# EAGLE design piezo-preamp-tickler_V2-RevD (EAGLE 8.2.1)

## Sheet 1 of 2
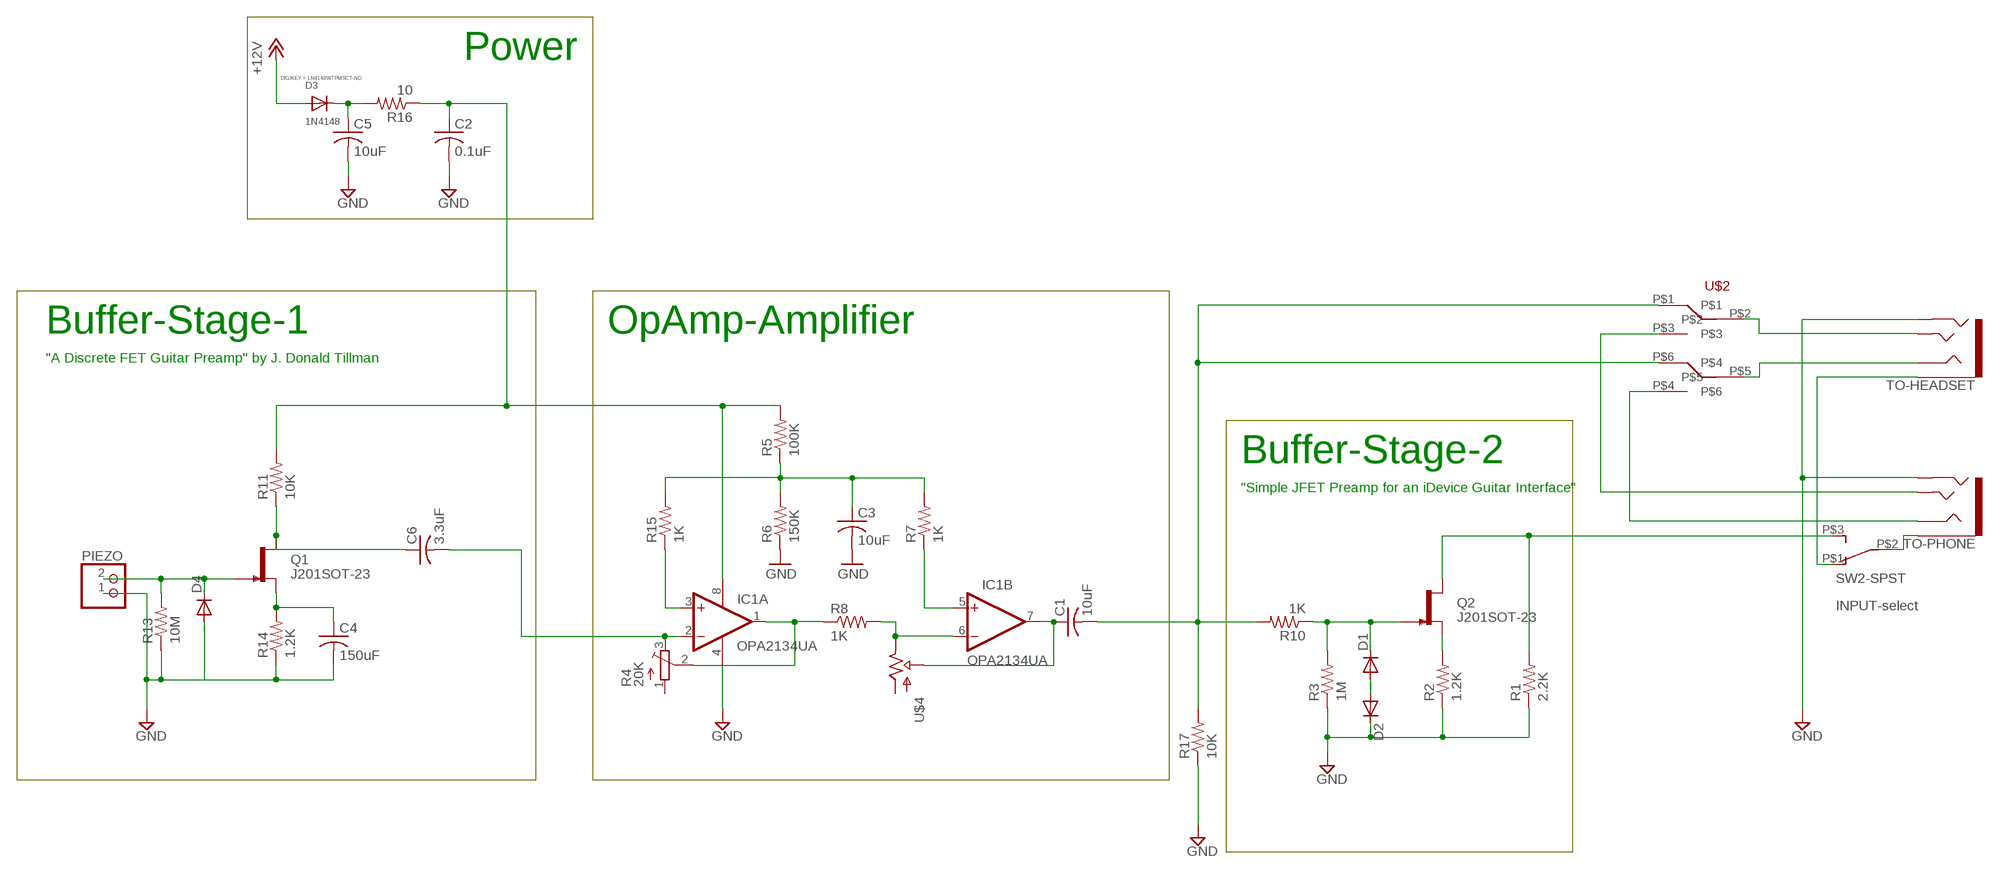
[diagram p0: schematic, sheet 1]

### Parts
C1  10uF  C-USC0805K  [C0805K]
C2  0.1uF  C-USC0805K  [C0805K]
C3  10uF  C-USC0805K  [C0805K]
C4  150uF  C-USC3216  [C3216]
C5  10uF  C-USC0805K  [C0805K]
C6  3.3uF  C-USC0805K  [C0805K]
D1  DIODE-SOD123  [SOD123]
D2  DIODE-SOD123  [SOD123]
D3  1N4148  DIODESOD-123  [SOD-123]
D4  DIODE-SOD123  [SOD123]
IC1  OPA2134UA  [SO08]
PIEZO  JST_2PIN-THM  [JST-PH-2-THM]
Q1  J201SOT-23  [SOT23-3]
Q2  J201SOT-23  [SOT23-3]
R1  2.2K  R-US_R0603  [R0603]
R2  1.2K  R-US_R0603  [R0603]
R3  1M  R-US_R0603  [R0603]
R4  20K  TRIMPOTTC33X  [TC33X]
R5  100K  R-US_R0603  [R0603]
R6  150K  R-US_R0603  [R0603]
R7  1K  R-US_R0603  [R0603]
R8  1K  R-US_R0603  [R0603]
R10  1K  R-US_R0603  [R0603]
R11  10K  R-US_R0603  [R0603]
R13  10M  R-US_R0603  [R0603]
R14  1.2K  R-US_R0603  [R0603]
R15  1K  R-US_R0603  [R0603]
R16  10  R-US_R0603  [R0603]
R17  10K  R-US_R0603  [R0603]
SW2-SPST  INPUT-select  SWITCH_SPDTCL-SB-12B  [SWITCH_SPDT_CL-SB-12B]
TO-HEADSET  AUDIO-JACK3LGPADS  [AUDIO-JACK-TRRS-SMD]
TO-PHONE  AUDIO-JACK3LGPADS  [AUDIO-JACK-TRRS-SMD]
U$2  SWITCH_DPDT  [SWITCH_DPDT_CL-SB-12B]
U$4  POT  [ALPS_POT]

### Nets
+12V: D3.A ; also sheet 2
GND: C2.2 C3.2 C4.2 C5.2 D2.C D4.A IC1.4(A:V-) PIEZO.1 R1.1 R2.1 R3.1 R6.1 R13.1 R14.1 R17.1 TO-HEADSET.RING2 TO-PHONE.RING2 ; also sheet 2
N$1: D1.A D2.A
N$2: D4.C PIEZO.2 Q1.3(G) R13.2
N$3: Q2.2(S) R2.2
N$5: IC1.5(B:+IN) R7.1
N$6: C1.1 IC1.7(B:OUT) U$4.P$2(WIPER)
N$7: IC1.6(B:-IN) R8.2 U$4.P$1(OUT)
N$9: C6.1 Q1.1(D) R11.1
N$10: D1.C Q2.3(G) R3.2 R10.1
N$11: C1.2 R10.2 R17.2 U$2.P$1 U$2.P$6
N$12: SW2-SPST.P$1 TO-HEADSET.EARTH
N$13: TO-HEADSET.TIP U$2.P$2
N$14: C4.1 Q1.2(S) R14.2
N$15: TO-HEADSET.RING1 U$2.P$5
N$16: C5.1 D3.C R16.2
N$17: SW2-SPST.P$2 TO-PHONE.EARTH
N$22: IC1.3(A:+IN) R15.1
N$23: C3.1 R5.1 R6.2 R7.2 R15.2
N$24: IC1.1(A:OUT) R4.2(S) R8.1
N$25: C2.1 IC1.8(A:V+) R5.2 R11.2 R16.1
N$26: TO-PHONE.RING1 U$2.P$4
N$27: TO-PHONE.TIP U$2.P$3
N$28: C6.2 IC1.2(A:-IN) R4.3(E)
SELECT: Q2.1(D) R1.2 SW2-SPST.P$3
Unconnected: R4.1(A) U$4.P$3(IN)

### Notes on the sheet
- Power
- Buffer-Stage-1 | OpAmp-Amplifier
- "A Discrete FET Guitar Preamp" by J. Donald Tillman
- Buffer-Stage-2
- "Simple JFET Preamp for an iDevice Guitar Interface"

## Sheet 2 of 2
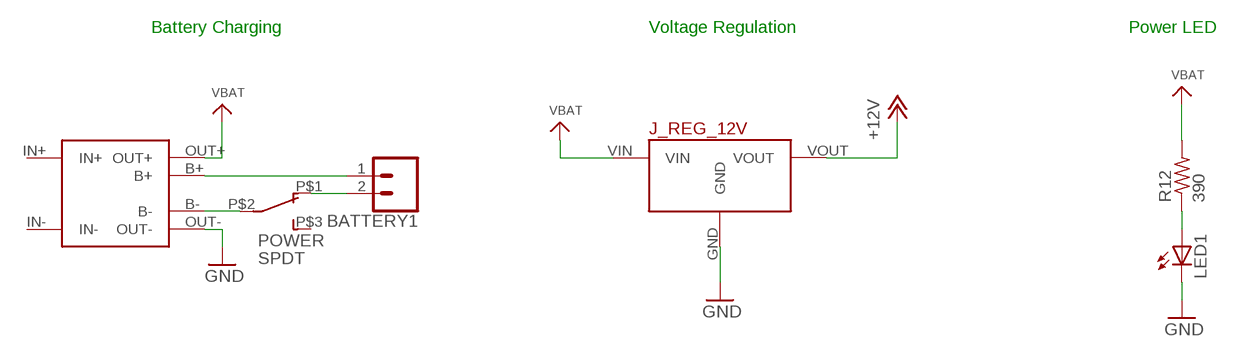
[diagram p1: schematic, sheet 2]

### Parts
BATTERY1  CONN_02LOCK  [1X02_LOCK]
J_REG_12V  POLOLU_VOLTAGE_REGULATORS_3PIN  [POLOLU_5V-12V_STEPUP_U3V12F5-U3V12F12]
LED1  LED3MM  [LED3MM]
POWER  SPDT  SWITCH_SPDTCL-SB-12B  [SWITCH_SPDT_CL-SB-12B]
R12  390  R-US_R0805  [R0805]
USB-LIPO-CHARGER  TP4056-MODULE  [TP4056-LITHIUM-PROTECTED-MODULE]

### Nets
+12V: J_REG_12V.VOUT ; also sheet 1
GND: J_REG_12V.GND LED1.K(C) USB-LIPO-CHARGER.OUT- ; also sheet 1
N$18: LED1.A R12.1
N$19: BATTERY1.1 USB-LIPO-CHARGER.B+
N$20: POWER.P$2 USB-LIPO-CHARGER.B-
N$21: BATTERY1.2 POWER.P$1
VBAT: J_REG_12V.VIN R12.2 USB-LIPO-CHARGER.OUT+
Unconnected: POWER.P$3

### Notes on the sheet
- Battery Charging | Voltage Regulation | Power LED

## Power pins joined to a net without a drawn wire
IN+: USB-LIPO-CHARGER.IN+
IN-: USB-LIPO-CHARGER.IN-

## Library data of the parts
BATTERY1 = SparkFun-Connectors:CONN_02: Multi connection point. Often used as Generic Header-pin footprint for 0.1 inch spaced/style header connections On any of the 0.1 inch spaced packages, you can populate with these: Break Away Headers - Straight <https://www.sparkfun.com/products/116> (PRT-00116) Break Away Male Headers - Right Angle <https://www.sparkfun.com/products/553> (PRT-00553) Female Headers <https://www.sparkfun.com/products/115> (PRT-00115) Break Away Headers - Machine Pin <https://www.sparkfun.com/products/117> (PRT-00117) Break Away Female Headers - Swiss Machine Pin <https://www.sparkfun.com/products/743> (PRT-00743) For SCREWTERMINALS and SPRING TERMINALS visit here: Screw Terimnals on SparkFun.com <https://www.sparkfun.com/search/results?term=Screw+Terminals> (5mm/3.5mm/2.54mm spacing) This device is also useful as a general connection point to wire up your design to another part of your project. Our various solder wires solder well into these plated through hole pads. Hook-Up Wire - Assortment (Stranded, 22 AWG) <https://www.sparkfun.com/products/11375> (PRT-11375) Hook-Up Wire - Assortment (Solid Core, 22 AWG) <https://www.sparkfun.com/products/11367> (PRT-11367) View the entire wire category on our website here <https://www.sparkfun.com/categories/141> Special notes: Molex polarized connector foot print use with: PRT-08233 with associated crimp pins and housings. 2.54_SCREWTERM for use with PRT-10571. 3.5mm Screw Terminal footprints for PRT-08084 5mm Screw Terminal footprints for use with PRT-08432
C1-C6 = adafruit:C-US: CAPACITOR, American symbol
D1 D2 D4 = diode:DIODE-: DIODE
D3 = adafruit:DIODE: Diode SMADIODE - SMA Surface Mount Package 20V 1A Schottky Diode Digikey: 641-1014-6-ND DO-1N4148 - Through Hole Small Current Diode SOD-123 20V 1 A (.5mV Vf) Schottky Diode - Digikey: MBRX120TPMSCT-ND SOD-323 10V 570mA (.38mV Vf, 3ns) Schottky Diode - Digikey: ZLLS410CT-ND SOD-523 30V 30mA Schottky Diode (RB751S-40TE61) - Digikey: RB751S-40TE61CT-ND SOT23-R/W - SOT23 Package (R = Solder Paste/Reflow Ovens, W = Hand-Soldering) BAT54Film 40V 300mA - Digikey: 497-7162-1-ND; DIGIKEY: 1N4148WTPMSCT-ND
IC1 = linear:OPA2*: Dual Operational Amplifier Low Power, Single-Supply, Rail-To-Rail Operational Amplifier Source: http://focus.ti.com/lit/ds/symlink/opa2345.pdf http://focus.ti.com .. opa241.pdf http://focus.ti.com/lit/ds/symlink/opa2134.pdf
J_REG_12V = CMU-ArtFab:POLOLU_VOLTAGE_REGULATORS_3PIN: Polulu 5V Step-Up/Step-Down Voltage REgulator S7V7F5
LED1 = led:LED: LED OSRAM: - CHIPLED LG R971, LG N971, LY N971, LG Q971, LY Q971, LO R971, LY R971 LH N974, LH R974 LS Q976, LO Q976, LY Q976 LO Q996 - Hyper CHIPLED LW Q18S LB Q993, LB Q99A, LB R99A - SideLED LS A670, LO A670, LY A670, LG A670, LP A670 LB A673, LV A673, LT A673, LW A673 LH A674 LY A675 LS A676, LA A676, LO A676, LY A676, LW A676 LS A679, LY A679, LG A679 - Hyper Micro SIDELED® LS Y876, LA Y876, LO Y876, LY Y876 LT Y87S - SmartLED LW L88C, LW L88S LB L89C, LB L89S, LG L890 LS L89K, LO L89K, LY L89K LS L896, LA L896, LO L896, LY L896 - TOPLED LS T670, LO T670, LY T670, LG T670, LP T670 LSG T670, LSP T670, LSY T670, LOP T670, LYG T670 LG T671, LOG T671, LSG T671 LB T673, LV T673, LT T673, LW T673 LH T674 LS T676, LA T676, LO T676, LY T676, LB T676, LH T676, LSB T676, LW T676 LB T67C, LV T67C, LT T67C, LS T67K, LO T67K, LY T67K, LW E67C LS E67B, LA E67B, LO E67B, LY E67B, LB E67C, LV E67C, LT E67C LW T67C LS T679, LY T679, LG T679 LS T770, LO T770, LY T770, LG T770, LP T770 LB T773, LV T773, LT T773, LW T773 LH T774 LS E675, LA E675, LY E675, LS T675 LS T776, LA T776, LO T776, LY T776, LB T776 LHGB T686 LT T68C, LB T68C - Hyper Mini TOPLED® LB M676 - Mini TOPLED Santana® LG M470 LS M47K, LO M47K, LY M47K Source: http://www.osram.convergy.de LUXEON: - LUMILED® LXK2-PW12-R00, LXK2-PW12-S00, LXK2-PW14-U00, LXK2-PW14-V00 LXK2-PM12-R00, LXK2-PM12-S00, LXK2-PM14-U00 LXK2-PE12-Q00, LXK2-PE12-R00, LXK2-PE12-S00, LXK2-PE14-T00, LXK2-PE14-U00 LXK2-PB12-K00, LXK2-PB12-L00, LXK2-PB12-M00, LXK2-PB14-N00, LXK2-PB14-P00, LXK2-PB14-Q00 LXK2-PR12-L00, LXK2-PR12-M00, LXK2-PR14-Q00, LXK2-PR14-R00 LXK2-PD12-Q00, LXK2-PD12-R00, LXK2-PD12-S00 LXK2-PH12-R00, LXK2-PH12-S00 LXK2-PL12-P00, LXK2-PL12-Q00, LXK2-PL12-R00 Source: www.luxeon.com KINGBRIGHT: KA-3528ASYC Source: www.kingbright.com
PIEZO = adafruit:JST_2PIN: JST 2-Pin Connectors of various flavors SMT-RA (S2B-PH-SM4) 4UConnector #17311 SMT (B2B-PH-SM4) THM-RA (S2B-PH) THM (B2B-PH)
POWER SW2-SPST = CMU-ArtFab:SWITCH_SPDT
Q1 Q2 = CMU-ArtFab:J201: N-channel JFET
R1-R3 R5-R8 R10-R17 = CMU-ArtFab:R-US_: RESISTOR, American symbol
R4 = adafruit:TRIMPOT: SMT trimmer potentiometer part number TC33X http://www.ladyada.net/library/eagle
TO-HEADSET TO-PHONE = Daniel:AUDIO-JACK3: Audio jack - 3.5mm TRRS variety - two rings.
U$2 = CMU-ArtFab:SWITCH_DPDT
U$4 = CMU-ArtFab:POT
USB-LIPO-CHARGER = CMU-ArtFab:TP4056-MODULE

## Net classes
0 default: width 0.152 mm, clearance 0.2 mm

## Board
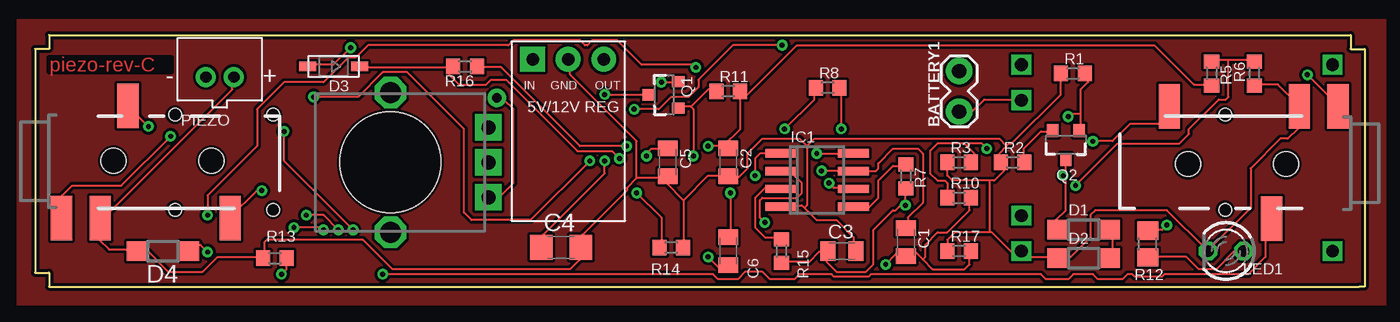
[diagram p2: board, top side]
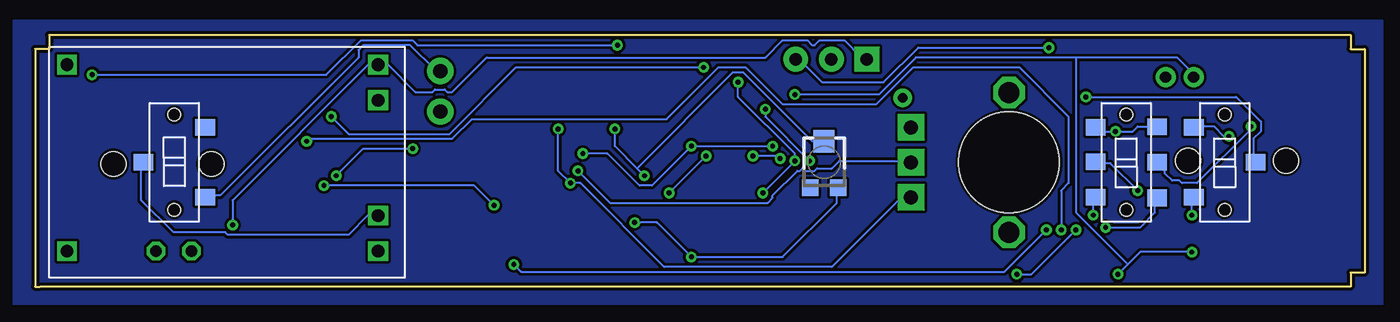
[diagram p3: board, bottom side, seen from below]

Size 95 x 18 mm. Coordinates in mm from the lower left corner, seen from the top.
Outline: 94.61,0 94.96,0
Outline: 94.61,0 1,0 1,1 0,1 0,17 1,17 1,18 94,18 94,17 95,17 95,0 94.61,0
Copper layers (1*16): Top 0.035mm / dielectric 1.5mm / Bottom 0.035mm
Design rules "default *": minimum track width 6mil, minimum drill 0.35mm, track to track 6mil, track to pad 6mil, pad to pad 6mil, via to via 6mil, smd to smd 6mil, copper to edge 8mil, drill to drill 6mil, minimum pad ring 10mil, minimum via ring 8mil, stop-mask expansion 4mil, vias tented up to drill 20mil, thermal gap 10mil

### Footprints (pad centres in the part's own frame; a part is rotated, then mirrored left to right if it is on the bottom)
1X02_LOCK = drill 1.016 pad 1.88: 1 -0.178,0; 2 2.718,0
C0805K = smd 1.1 x 1.4: 1 -1,0; 2 1,0
C3216 = smd 1.6 x 1.8: 1 -1.4,0; 2 1.4,0
SOD123 = smd 1.4 x 1.4: A 1.9,0; C -1.9,0
SOD-123 = smd 1.2 x 0.7: A 1.85,0; C -1.85,0
SO08 = smd 0.6 x 2.2: 1 -1.905,-2.6; 2 -0.635,-2.6; 3 0.635,-2.6; 4 1.905,-2.6; 5 1.905,2.6; 6 0.635,2.6; 7 -0.635,2.6; 8 -1.905,2.6
POLOLU_5V-12V_STEPUP_U3V12F5-U3V12F12 = drill 0.9 pad 1.778: GND 0,-6.35; VOUT -2.54,-6.35 | drill 0.9 pad 1.778 square: VIN 2.54,-6.35
LED3MM = drill 0.813 octagon: A -1.27,0; K 1.27,0
JST-PH-2-THM = drill 0.8 pad 1.422: 1 1,0; 2 -1,0
SWITCH_SPDT_CL-SB-12B = smd 1.2 x 1.4: P$1 -2.5,-2.2; P$2 0,2.2; P$3 2.5,-2.2 | hole 0.9: -3.4,0; 3.4,0
SOT23-3 = smd 0.8 x 0.9: 1 -0.95,-1; 2 0.95,-1; 3 0,1.1
R0603 = smd 1 x 1.1: 1 -0.85,0; 2 0.85,0
TC33X = smd 1.2 x 1.2: 1 -1,-1.825; 3 1,-1.825 | smd 1.5 x 1.6: 2 0,1.5
R0805 = smd 1.3 x 1.5: 1 -0.95,0; 2 0.95,0
AUDIO-JACK-TRRS-SMD = smd 1.524 x 3.175: EARTH -2.114,-5.271; RING1 2.644,2.759; RING2 0.66,-5.271; TIP 9.948,-5.271 | hole 1.778: 1.6,-1.15; 8.6,-1.15
SWITCH_DPDT_CL-SB-12B = smd 1.2 x 1.4: P$1 -2.5,-2.2; P$2 -0.04,-2.2; P$3 2.5,-2.2; P$4 2.54,2.2; P$5 0,2.2; P$6 -2.54,2.2 | hole 0.9: -3.4,0; 3.4,0
ALPS_POT = drill 1 pad 1.88 square: P$1 7,-2.5; P$2 7,0; P$3 7,2.5 | drill 1.5 octagon: P$4 0,-5; P$5 0,5 | hole 7.2: 0,0
TP4056-LITHIUM-PROTECTED-MODULE = drill 0.9 square: B+ 10.795,4.445; B- 10.795,-3.81; IN+ -11.43,6.985; IN- -11.43,-6.35; OUT+ 10.795,6.985; OUT- 10.795,-6.35

### Placement (x,y rotation side)
BATTERY1  66.04,12.7 90 top
C1  62.23,3.17 270 top
C2  49.53,8.89 270 top
C3  57.66,2.54 0 top
C4  37.59,2.79 0 top
C5  45.21,8.89 270 top
C6  49.53,2.54 270 top
D1  74.93,4.06 0 top
D2  74.93,2.03 0 top
D3  21.34,15.75 180 top
D4  9.14,2.54 180 top
IC1  55.88,7.62 270 top
J_REG_12V  38.1,9.91 180 top
LED1  85.09,2.54 180 top
PIEZO  13.21,14.99 0 top
POWER  85.04,8.89 90 bottom
Q1  44.96,13.72 90 top
Q2  73.66,10.16 180 top
R1  74.17,15.24 0 top
R2  69.85,8.89 0 top
R3  66.04,8.89 0 top
R4  38.61,8.89 0 bottom
R5  84.07,15.24 270 top
R6  87.12,15.24 90 top
R7  62.23,7.87 270 top
R8  56.64,14.22 0 top
R10  66.04,6.35 0 top
R11  49.53,13.97 0 top
R12  79.5,3.05 90 top
R13  17.14,2.03 0 top
R14  45.47,2.79 180 top
R15  53.34,2.54 270 top
R16  30.73,15.75 180 top
R17  66.04,2.54 0 top
SW2-SPST  10,8.89 270 bottom
TO-HEADSET  4,10.16 0 top
TO-PHONE  91,7.62 180 top
U$2  17.02,8.89 270 bottom
U$4  25.4,8.89 0 top
USB-LIPO-CHARGER  81.28,8.89 0 bottom

### Tracks (layer width: path | path; a pad name or v marks a point on that pad's centre or on a via)
+12V  (via drill 0.35)
  Top 0.152: v22.55,17.09 21.32,15.86 19.56,15.86 D3.A
  Bottom 0.152: v22.55,17.09 31.89,17.09 34.36,14.62 38.76,14.62 40.53,16.39 J_REG_12V.VOUT
GND
  Top 0.152: 68.19,3.88 68.37,3.88 69.78,2.47 70.48,2.47 USB-LIPO-CHARGER.OUT- 70.66,2.47 71.01,2.11 72.95,2.11 D2.C 73.12,2.11 74,2.11 75.41,3.52 75.41,5.11 75.77,5.46 80.88,5.46 83.69,2.64 LED1.K 83.87,2.64 86.87,5.64 86.87,8.46 88.98,10.57 89.51,10.57 90.21,11.28 90.21,12.86 TO-PHONE.RING2 90.21,13.04 88.81,14.45 87.22,14.45 R6.1 | 68.19,3.88 65.72,3.88 65.19,3.35 65.19,2.64 R17.1 | 68.19,7.58 68.54,7.58 69.25,8.28 69.25,8.63 69.07,8.81 R2.1 68.89,8.99 68.89,9.52 69.42,10.04 | 68.19,7.58 65.55,7.58 65.19,7.93 65.19,8.81 R3.1 | 69.42,10.04 69.6,10.22 69.78,10.22 73.3,13.74 73.3,15.15 R1.1 | 68.19,7.58 68.19,3.88 | PIEZO.1 14.1,14.98 14.1,14.1 4.76,4.76 TO-HEADSET.RING2 4.58,4.76 4.58,3.35 5.29,2.64 7.22,2.64 D4.A 7.4,2.64 7.93,2.64 9.52,1.06 11.98,1.06 13.04,2.11 16.21,2.11 R13.1 16.39,2.11 16.39,3.17 16.56,3.35 23.43,3.35 25.55,1.23 38.23,1.23 38.94,1.94 38.94,2.64 C4.2 39.12,2.82 39.12,3.7 42.29,6.87 42.29,7.05 42.99,7.75 | 54.97,5.64 54.8,5.82 53.39,5.82 IC1.4 | 54.97,5.64 55.85,4.76 57.27,4.76 58.5,3.52 58.5,2.64 C3.2 | 46.34,6.17 46.34,2.82 R14.1 | 46.34,6.17 45.11,7.4 45.11,7.75 | 46.34,6.17 48.1,7.93 49.51,7.93 C2.2 49.69,7.75 50.22,7.75 50.92,8.46 50.92,9.52 51.98,10.57 54.62,10.57 55.15,10.04 | 45.11,7.75 42.99,7.75 | 45.11,7.75 C5.2 | 42.99,7.75 42.99,10.4 38.23,15.15 38.23,16.21 J_REG_12V.GND | 54.97,5.64 55.15,5.82 55.15,10.04 | 69.42,10.04 68.89,10.57 55.68,10.57 55.15,10.04
N$1
  Top 0.152: D2.A 77,2.11 77,4.05 D1.A
N$2  (via drill 0.35)
  Top 0.152: v17.62,0.88 17.97,1.23 17.97,1.94 R13.2 | v12.33,2.47 11.8,3 11.45,3 11.1,2.64 D4.C | v40.7,13.74 43.7,13.74 Q1.3
  Bottom 0.152: 16.91,1.59 16.03,2.47 v12.33,2.47 | 16.91,1.59 v17.62,0.88 | v40.7,13.74 34.71,13.74 32.07,16.39 20.61,16.39 | 20.61,16.39 13.39,16.39 12.16,15.15 PIEZO.2 | 16.91,1.59 20.61,5.29 20.61,16.39
N$3
  Top 0.152: Q2.2 72.59,11.1 71.89,11.1 70.66,9.87 70.66,8.99 R2.2
N$4
  pour Top: -1.27,19.05 -1.27,-1.27 96.52,-1.27 96.52,19.05
N$5
  Top 0.152: R7.1 62.2,8.63 61.32,8.63 60.26,7.58 60.26,6.34 59.56,5.64 58.5,5.64 IC1.5
N$6  (via drill 0.35)
  Top 0.152: C1.1 62.38,4.23 62.38,4.93 63.43,5.99 63.43,9.52 63.08,9.87 61.32,9.87 60.26,8.81 60.26,8.46 60.08,8.28 58.5,8.28 IC1.7 58.32,8.28 v56.21,8.28
  Bottom 0.152: v56.21,8.28 53.92,5.99 42.64,5.99 42.29,6.34 42.29,6.52 40.53,8.28 40.35,8.28 40.17,8.46 40,8.28 39.29,8.28 39.12,8.46 38.06,8.46 37.53,8.99 32.42,8.99 U$4.P$2
N$7  (via drill 0.35, 0.7 pad 1.3)
  Top 0.152: v57.62,11.28 57.62,14.1 R8.2 | v56.74,7.4 57.09,7.05 58.32,7.05 IC1.6 | v33,13.5 33.13,13.39 33.48,13.39 34.18,12.69 34.18,7.4 33.3,6.52 32.42,6.52 U$4.P$1
  Bottom 0.152: v57.62,11.28 57.62,8.28 v56.74,7.4 56.03,7.4 50.04,1.41 38.06,1.41 33.13,6.34 32.42,6.34 U$4.P$1
N$8
  pour Bottom: -1.27,19.05 -1.27,-1.27 96.52,-1.27 96.52,19.05
N$9  (via drill 0.35)
  Top 0.152: 46.87,12.86 45.99,12.86 Q1.1 | 46.87,12.86 48.1,14.1 48.63,14.1 R11.1 | v49.69,6.7 49.69,3.7 C6.1 | v47.05,9.34 47.05,12.69 46.87,12.86
  Bottom 0.152: v47.05,9.34 v49.69,6.7
N$10  (via drill 0.35)
  Top 0.152: 66.6,10.04 67.13,9.52 67.13,9.16 66.96,8.99 R3.2 | 66.6,10.04 66.43,10.22 64.49,10.22 63.96,9.69 63.96,8.11 64.49,7.58 65.02,7.58 65.19,7.4 65.19,6.52 R10.1 | 73.65,7.93 73.65,5.46 72.95,4.76 72.95,4.23 D1.C | 73.65,7.93 73.65,8.99 Q2.3 | 66.6,10.04 66.78,10.22 67.66,10.22 v68.01,9.87 | 73.65,7.93 v73.47,7.93
  Bottom 0.152: v68.01,9.87 71.54,9.87 v73.47,7.93
N$11  (via drill 0.35)
  Top 0.152: 63.43,1.94 62.9,2.47 62.55,2.47 62.38,2.29 C1.2 62.2,2.29 61.49,2.29 v60.79,1.59 | 63.43,1.94 64.14,1.23 66.43,1.23 66.78,1.59 66.78,2.47 R17.2 | 63.43,1.94 63.61,2.11 63.61,3 64.49,3.88 65.19,3.88 66.78,5.46 66.78,6.34 R10.2 | v17.8,11.1 17.8,8.99 v22.73,4.05
  Bottom 0.152: U$2.P$6 14.98,11.45 16.21,11.45 16.56,11.1 v17.8,11.1 19.03,11.1 19.21,11.28 U$2.P$1 | v22.73,4.05 25.73,1.06 60.26,1.06 v60.79,1.59
N$12  (via drill 0.35)
  Top 0.152: v9.69,10.75 6.17,7.22 2.64,7.22 1.94,6.52 1.94,4.93 TO-HEADSET.EARTH
  Bottom 0.152: v9.69,10.75 10.04,10.75 10.75,11.45 12.16,11.45 SW2-SPST.P$1
N$13  (via drill 0.35)
  Top 0.152: v16.21,6.87 15.86,6.87 13.92,4.93 TO-HEADSET.TIP
  Bottom 0.152: v16.21,6.87 18.15,8.81 19.21,8.81 U$2.P$2
N$14  (via drill 0.35)
  Top 0.152: v44.76,14.62 45.81,14.62 Q1.2 | v40.7,8.99 40.7,8.11 36.3,3.7 36.3,2.82 C4.1 | v42.99,6.7 44.76,4.93 44.76,2.82 R14.2
  Bottom 0.152: v44.76,14.62 44.76,13.57 40.7,9.52 v40.7,8.99 v42.99,6.7
N$15  (via drill 0.35)
  Top 0.152: v8.11,11.45 6.7,12.86 TO-HEADSET.RING1
  Bottom 0.152: v8.11,11.45 8.11,11.28 11.98,7.4 13.04,7.4 13.21,7.58 13.74,7.58 14.27,8.11 14.27,8.28 14.8,8.81 U$2.P$5
N$16  (via drill 0.35)
  Top 0.152: 29.6,15.68 23.26,15.68 D3.C | 29.6,15.68 29.78,15.68 R16.2 29.6,15.68 | v43.7,9.34 43.7,9.52 44.05,9.87 45.11,9.87 C5.1 | v41.76,9.16 41.23,9.69 38.76,9.69 33.65,14.8 32.6,14.8 32.24,14.45 30.31,14.45 29.6,15.15 29.6,15.68
  Bottom 0.152: v43.7,9.34 41.94,9.34 v41.76,9.16
N$17  (via drill 0.35)
  Top 0.152: v19.91,13.57 23.08,13.57 24.84,15.33 26.61,15.33 30.66,11.28 30.66,5.29 31.19,4.76 35.42,4.76 v39.65,8.99 | v42.82,12.69 44.58,12.69 45.46,13.57 46.69,13.57 47.4,14.27 47.4,14.8 49.87,17.27 v53.39,17.27 | v90.92,15.15 93.03,13.04 TO-PHONE.EARTH
  Bottom 0.152: v19.91,13.57 9.16,13.57 7.4,11.8 7.4,11.1 7.93,10.57 7.93,8.99 SW2-SPST.P$2 | v39.65,8.99 42.82,12.16 v42.82,12.69 | v53.39,17.27 67.66,17.27 68.01,17.62 71.71,17.62 74.18,15.15 v90.92,15.15
N$18
  Top 0.152: R12.1 79.64,2.11 82.28,2.11 83.17,1.23 84.4,1.23 85.63,2.47 86.34,2.47 LED1.A
N$19
  Top 0.152: USB-LIPO-CHARGER.B+ 70.48,13.39 67.84,13.39 66.96,12.51 66.08,12.51 BATTERY1.1
N$20
  Bottom 0.152: POWER.P$2 87.39,8.81 87.39,6.17 85.11,3.88 81.4,3.88 81.23,3.7 72.59,3.7 71.19,5.11 70.66,5.11 USB-LIPO-CHARGER.B-
N$21
  Bottom 0.152: POWER.P$1 82.81,6.52 81.76,6.52 71.89,16.39 71.89,16.91 71.54,17.27 68.19,17.27 66.43,15.51 66.08,15.51 BATTERY1.2
N$22
  Top 0.152: R15.1 53.21,3.52 52.16,3.52 51.45,4.23 51.45,6.34 52.16,7.05 53.21,7.05 IC1.3
N$23  (via drill 0.35)
  Top 0.152: 85.28,16.21 87.04,16.21 R6.2 | 85.28,16.21 84.22,16.21 R5.1 | 56.56,2.47 56.03,2.47 55.33,1.76 53.39,1.76 R15.2 | 62.02,5.99 61.49,5.46 61.32,5.46 59.91,4.05 59.91,1.59 59.38,1.06 57.27,1.06 56.56,1.76 56.56,2.47 | 62.02,5.99 62.2,6.17 62.2,6.87 R7.2 | 56.56,2.47 C3.1 | 85.28,16.21 85.28,13.57 85.11,13.39 84.58,13.39 82.46,11.28 82.46,10.92 81.76,10.22 77.35,10.22 v74.36,7.22 | 62.02,5.99 v62.2,5.82
  Bottom 0.152: v74.36,7.22 63.61,7.22 v62.2,5.82
N$24  (via drill 0.35)
  Top 0.152: v53.56,11.28 55.68,13.39 55.68,14.1 R8.1 | v51.45,7.93 51.45,9.16 51.8,9.52 53.21,9.52 IC1.1
  Bottom 0.152: v53.56,11.28 53.56,10.04 51.98,8.46 | v51.45,7.93 51.98,8.46 | 51.98,8.46 45.11,15.33 44.4,15.33 39.47,10.4 38.76,10.4 R4.2
N$25  (via drill 0.35)
  Top 0.152: v42.29,10.04 38.94,10.04 33.3,15.68 31.72,15.68 R16.1 | 49.16,10.04 49.51,10.04 C2.1 49.16,10.04 | 49.16,10.04 v48.1,10.04 | 50.39,13.74 50.39,11.28 49.16,10.04 | 50.39,13.74 50.39,13.92 R11.2 50.39,13.74 | 50.39,13.74 50.92,13.74 54.45,17.27 80,17.27 82.81,14.45 84.05,14.45 R5.2 | v55.85,9.52 58.32,9.52 IC1.8
  Bottom 0.152: v42.29,10.04 v48.1,10.04 50.92,7.22 51.8,7.22 54.09,9.52 v55.85,9.52
N$26  (via drill 0.35)
  Top 0.152: v18.5,4.23 20.44,4.23 v20.61,4.05 | v24.84,0.88 48.45,0.88 48.81,0.53 50.22,0.53 50.75,1.06 51.98,1.06 52.51,0.53 54.27,0.53 54.62,0.88 56.91,0.88 57.09,0.7 59.56,0.7 59.73,0.88 71.89,0.88 72.24,0.53 73.83,0.53 74.18,0.88 75.59,0.88 75.94,0.53 77.7,0.53 78.06,0.88 78.41,0.88 78.58,0.7 80.52,0.7 80.7,0.88 86.69,0.88 87.92,2.11 87.92,4.41 88.28,4.76 TO-PHONE.RING1
  Bottom 0.152: v18.5,4.23 16.03,4.23 14.98,5.29 14.98,6.34 U$2.P$4 | v20.61,4.05 23.79,0.88 v24.84,0.88
N$27  (via drill 0.35)
  Top 0.152: v19.38,5.11 20.61,5.11 v21.67,4.05 | v75.59,10.4 77,10.4 78.23,11.63 80.35,11.63 81.05,12.33 TO-PHONE.TIP
  Bottom 0.152: v19.38,5.11 19.38,6.34 U$2.P$3 | v21.67,4.05 21.67,6.87 21.14,7.4 21.14,12.16 24.67,15.68 32.24,15.68 34.89,13.04 41.58,13.04 44.23,15.68 46.16,15.68 49.87,11.98 63.78,11.98 65.19,10.57 75.41,10.57 v75.59,10.4
N$28  (via drill 0.35)
  Top 0.152: v48.1,2.11 48.81,1.41 49.51,1.41 C6.2 | v52.16,4.58 51.8,4.93 51.8,6.17 51.98,6.34 54.45,6.34 54.8,6.7 54.8,7.4 54.09,8.11 53.39,8.11 IC1.2
  Bottom 0.152: R4.3 37.71,7.05 37.71,5.99 41.58,2.11 v48.1,2.11 50.57,4.58 v52.16,4.58
SELECT  (via drill 0.35)
  Top 0.152: 74.71,12.33 74.71,14.1 75.24,14.62 75.24,14.98 75.06,15.15 R1.2 | 74.71,12.33 74.71,11.28 Q2.1 | v12.33,5.11 12.33,6.52 15.86,10.04 15.86,12.69 17.8,14.62 20.61,14.62 22.38,16.39 22.91,16.39 23.79,17.27 33.83,17.27 34.18,17.62 38.94,17.62 39.29,17.27 39.47,17.27 39.82,17.62 41.58,17.62 43.34,15.86 47.05,15.86 v47.22,15.68 | v73.83,12.16 74,12.33 74.71,12.33
  Bottom 0.152: v12.33,5.11 12.33,6.34 SW2-SPST.P$3 | v47.22,15.68 60.61,15.68 65.37,10.92 72.59,10.92 v73.83,12.16
VBAT  (via drill 0.35)
  Top 0.152: v80.88,4.41 80.52,4.05 79.64,4.05 R12.2
  Bottom 0.152: v80.88,4.41 80.88,6.17 71.19,15.86 70.66,15.86 USB-LIPO-CHARGER.OUT+ 70.48,15.86 69.78,15.86 67.84,13.92 66.6,13.92 66.43,14.1 65.72,14.1 65.55,13.92 65.19,13.92 62.73,16.39 42.82,16.39 41.58,17.62 39.82,17.62 39.47,17.27 39.29,17.27 38.94,17.62 37.18,17.62 35.95,16.39 35.59,16.39 J_REG_12V.VIN

### Text on the board
Top: piezo-rev-C